# Altium schematic sheet FPGA3.SchDoc
size A4; SheetNumber: 9; SheetTotal: 9
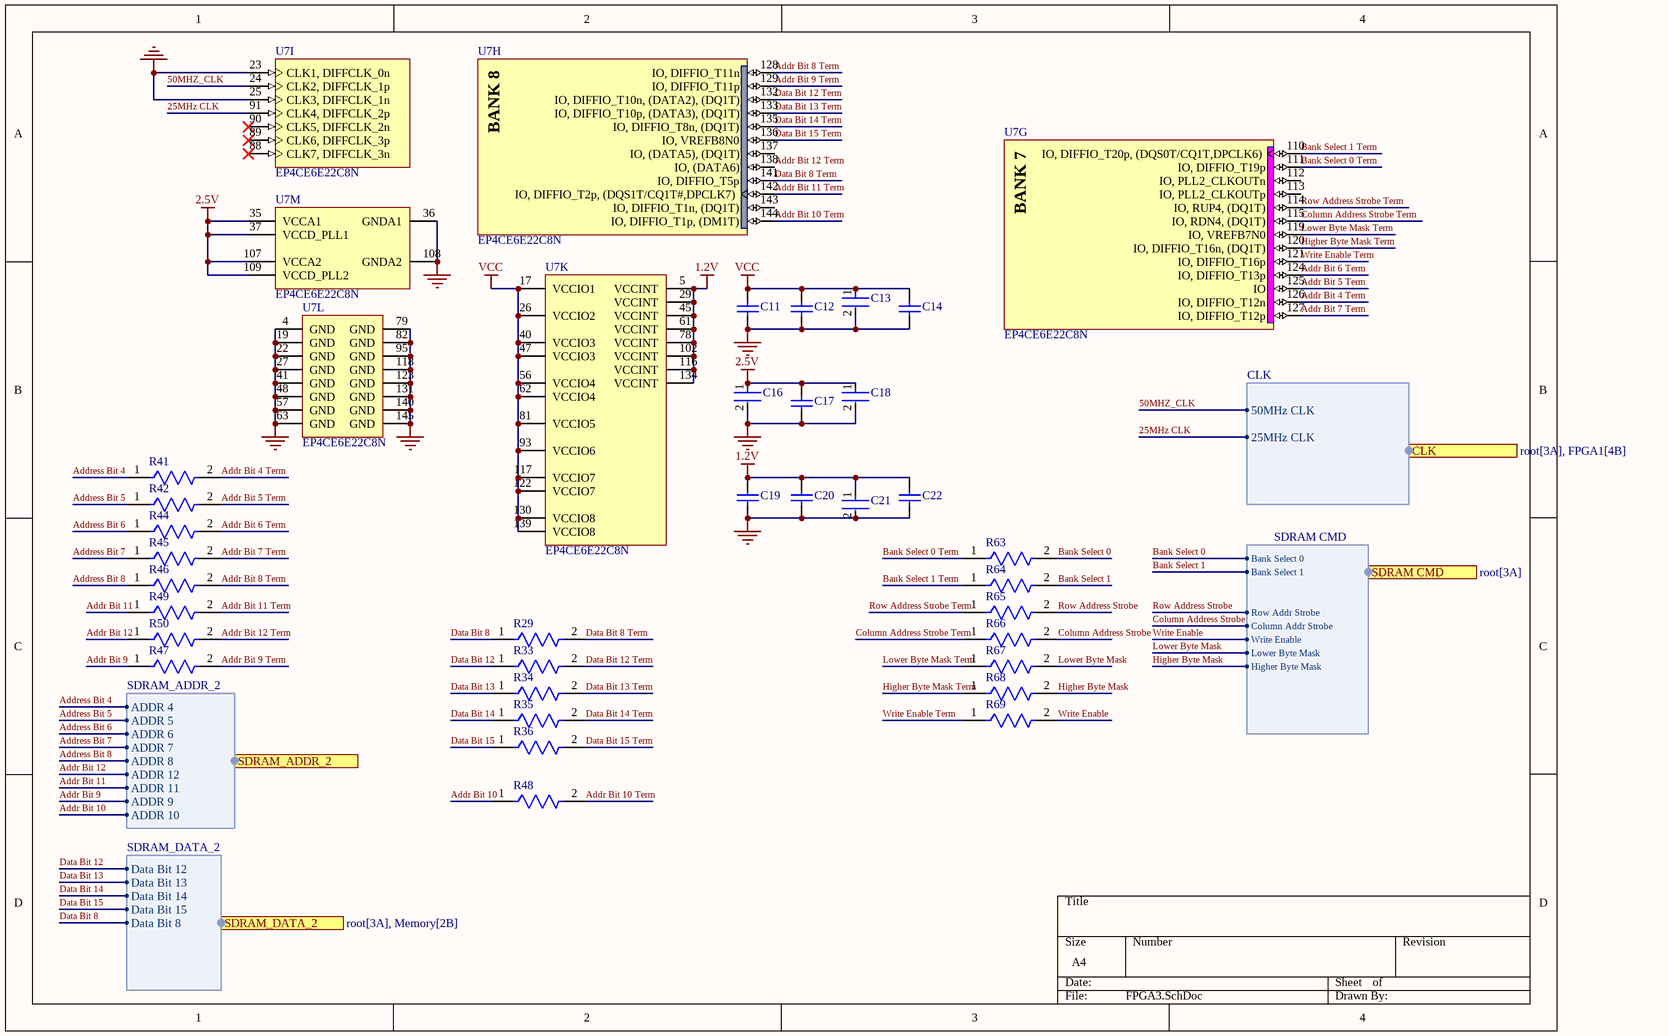
[diagram p0: FPGA3.SchDoc]

## Parts
C11  C0603C105K9PACTU  [CAPC1608X90X35LL15T15]  (value not drawn)
C12  C0603C105K9PACTU  [CAPC1608X90X35LL15T15]  (value not drawn)
C13  CC0603KRX7R9BB104  [FP-CC0603-DA-MFG]  (value not drawn)
C14  C0805S472K5RACTU  [CAPC2013X145X50ML20T25]  (value not drawn)
C16  CL10B102KB8NNNC  [FP-CL10-IPC_C]  (value not drawn)
C17  C0805S472K5RACTU  [CAPC2013X145X50ML20T25]  (value not drawn)
C18  CC0603KRX7R9BB104  [FP-CC0603-DA-MFG]  (value not drawn)
C19  C0603C105K9PACTU  [CAPC1608X90X35LL15T15]  (value not drawn)
C20  C0603C105K9PACTU  [CAPC1608X90X35LL15T15]  (value not drawn)
C21  CC0603KRX7R9BB104  [FP-CC0603-DA-MFG]  (value not drawn)
C22  C0805S472K5RACTU  [CAPC2013X145X50ML20T25]  (value not drawn)
R29  RT0402BRE0750RL  [FP-RT0402-0_35-MFG]  (value not drawn)
R33  RT0402BRE0750RL  [FP-RT0402-0_35-MFG]  (value not drawn)
R34  RT0402BRE0750RL  [FP-RT0402-0_35-MFG]  (value not drawn)
R35  RT0402BRE0750RL  [FP-RT0402-0_35-MFG]  (value not drawn)
R36  RT0402BRE0750RL  [FP-RT0402-0_35-MFG]  (value not drawn)
R41  RT0402BRE0750RL  [FP-RT0402-0_35-MFG]  (value not drawn)
R42  RT0402BRE0750RL  [FP-RT0402-0_35-MFG]  (value not drawn)
R44  RT0402BRE0750RL  [FP-RT0402-0_35-MFG]  (value not drawn)
R45  RT0402BRE0750RL  [FP-RT0402-0_35-MFG]  (value not drawn)
R46  RT0402BRE0750RL  [FP-RT0402-0_35-MFG]  (value not drawn)
R47  RT0402BRE0750RL  [FP-RT0402-0_35-MFG]  (value not drawn)
R48  RT0402BRE0750RL  [FP-RT0402-0_35-MFG]  (value not drawn)
R49  RT0402BRE0750RL  [FP-RT0402-0_35-MFG]  (value not drawn)
R50  RT0402BRE0750RL  [FP-RT0402-0_35-MFG]  (value not drawn)
R63  RT0402BRE0750RL  [FP-RT0402-0_35-MFG]  (value not drawn)
R64  RT0402BRE0750RL  [FP-RT0402-0_35-MFG]  (value not drawn)
R65  RT0402BRE0750RL  [FP-RT0402-0_35-MFG]  (value not drawn)
R66  RT0402BRE0750RL  [FP-RT0402-0_35-MFG]  (value not drawn)
R67  RT0402BRE0750RL  [FP-RT0402-0_35-MFG]  (value not drawn)
R68  RT0402BRE0750RL  [FP-RT0402-0_35-MFG]  (value not drawn)
R69  RT0402BRE0750RL  [FP-RT0402-0_35-MFG]  (value not drawn)
U7  EP4CE6E22C8N  [EQFP144_A-165_D2-54_M]  (parts G,H,I,K,L,M of 13)

## Ports
CLK (harness CLK, see root[3A], FPGA1[4B]), SDRAM CMD (harness SDRAM CMD, see root[3A]), SDRAM_ADDR_2 (harness SDRAM_ADDR_2, see root[3A], Memory[2C]), SDRAM_DATA_2 (harness SDRAM_DATA_2, see root[3A], Memory[2B])

## Harnesses
CLK: 50MHz CLK, 25MHz CLK
SDRAM CMD: Bank Select 0, Bank Select 1, Row Addr Strobe, Column Addr Strobe, Write Enable, Lower Byte Mask, Higher Byte Mask
SDRAM_ADDR_2: ADDR 4, ADDR 5, ADDR 6, ADDR 7, ADDR 8, ADDR 12, ADDR 11, ADDR 9, ADDR 10
SDRAM_DATA_2: Data Bit 12, Data Bit 13, Data Bit 14, Data Bit 15, Data Bit 8

## Nets
1.2V: C19.2 C20.2 C21.1 C22.2 U7.5(VCCINT) U7.29(VCCINT) U7.45(VCCINT) U7.61(VCCINT) U7.78(VCCINT) U7.102(VCCINT) U7.116(VCCINT) U7.134(VCCINT)
2.5V: C16.1 C17.2 C18.1 U7.35(VCCA1) U7.37(VCCD_PLL1) U7.107(VCCA2) U7.109(VCCD_PLL2)
GND: C11.1 C12.1 C13.2 C14.1 C16.2 C17.1 C18.2 C19.1 C20.1 C21.2 C22.1 U7.4(GND) U7.19(GND) U7.22(GND) U7.23(CLK1,_DIFFCLK_0n) U7.25(CLK3,_DIFFCLK_1n) U7.27(GND) U7.36(GNDA1) U7.41(GND) U7.48(GND) U7.57(GND) U7.63(GND) U7.79(GND) U7.82(GND) U7.95(GND) U7.108(GNDA2) U7.118(GND) U7.123(GND) U7.131(GND) U7.140(GND) U7.145(GND)
VCC: C11.2 C12.2 C13.1 C14.2 U7.17(VCCIO1) U7.26(VCCIO2) U7.40(VCCIO3) U7.47(VCCIO3) U7.56(VCCIO4) U7.62(VCCIO4) U7.81(VCCIO5) U7.93(VCCIO6) U7.117(VCCIO7) U7.122(VCCIO7) U7.130(VCCIO8) U7.139(VCCIO8)
25MHz CLK: U7.91(CLK4,_DIFFCLK_2p) ; port CLK.25MHz CLK
50MHZ_CLK: U7.24(CLK2,_DIFFCLK_1p) ; port CLK.50MHz CLK
Addr Bit 4 Term: R41.2 U7.126(IO,_DIFFIO_T12n)
Addr Bit 5 Term: R42.2 U7.125(IO)
Addr Bit 6 Term: R44.2 U7.124(IO,_DIFFIO_T13p)
Addr Bit 7 Term: R45.2 U7.127(IO,_DIFFIO_T12p)
Addr Bit 8 Term: R46.2 U7.128(IO,_DIFFIO_T11n)
Addr Bit 9: R47.1 ; port SDRAM_ADDR_2.ADDR 9
Addr Bit 9 Term: R47.2 U7.129(IO,_DIFFIO_T11p)
Addr Bit 10: R48.1 ; port SDRAM_ADDR_2.ADDR 10
Addr Bit 10 Term: R48.2 U7.144(IO,_DIFFIO_T1p,_(DM1T))
Addr Bit 11: R49.1 ; port SDRAM_ADDR_2.ADDR 11
Addr Bit 11 Term: R49.2 U7.142(IO,_DIFFIO_T2p,_(DQS1T/CQ1T#,DPCLK7))
Addr Bit 12: R50.1 ; port SDRAM_ADDR_2.ADDR 12
Addr Bit 12 Term: R50.2 U7.138(IO,_(DATA6))
Address Bit 4: R41.1 ; port SDRAM_ADDR_2.ADDR 4
Address Bit 5: R42.1 ; port SDRAM_ADDR_2.ADDR 5
Address Bit 6: R44.1 ; port SDRAM_ADDR_2.ADDR 6
Address Bit 7: R45.1 ; port SDRAM_ADDR_2.ADDR 7
Address Bit 8: R46.1 ; port SDRAM_ADDR_2.ADDR 8
Bank Select 0: R63.2 ; port SDRAM CMD.Bank Select 0
Bank Select 0 Term: R63.1 U7.111(IO,_DIFFIO_T19p)
Bank Select 1: R64.2 ; port SDRAM CMD.Bank Select 1
Bank Select 1 Term: R64.1 U7.110(IO,_DIFFIO_T20p,_(DQS0T/CQ1T,DPCLK6))
Column Address Strobe: R66.2 ; port SDRAM CMD.Column Addr Strobe
Column Address Strobe Term: R66.1 U7.115(IO,_RDN4,_(DQ1T))
Data Bit 8: R29.1 ; port SDRAM_DATA_2.Data Bit 8
Data Bit 8 Term: R29.2 U7.141(IO,_DIFFIO_T5p)
Data Bit 12: R33.1 ; port SDRAM_DATA_2.Data Bit 12
Data Bit 12 Term: R33.2 U7.132(IO,_DIFFIO_T10n,_(DATA2),_(DQ1T))
Data Bit 13: R34.1 ; port SDRAM_DATA_2.Data Bit 13
Data Bit 13 Term: R34.2 U7.133(IO,_DIFFIO_T10p,_(DATA3),_(DQ1T))
Data Bit 14: R35.1 ; port SDRAM_DATA_2.Data Bit 14
Data Bit 14 Term: R35.2 U7.135(IO,_DIFFIO_T8n,_(DQ1T))
Data Bit 15: R36.1 ; port SDRAM_DATA_2.Data Bit 15
Data Bit 15 Term: R36.2 U7.136(IO,_VREFB8N0)
Higher Byte Mask: R68.2 ; port SDRAM CMD.Higher Byte Mask
Higher Byte Mask Term: R68.1 U7.120(IO,_DIFFIO_T16n,_(DQ1T))
Lower Byte Mask: R67.2 ; port SDRAM CMD.Lower Byte Mask
Lower Byte Mask Term: R67.1 U7.119(IO,_VREFB7N0)
Row Address Strobe: R65.2 ; port SDRAM CMD.Row Addr Strobe
Row Address Strobe Term: R65.1 U7.114(IO,_RUP4,_(DQ1T))
Write Enable: R69.2 ; port SDRAM CMD.Write Enable
Write Enable Term: R69.1 U7.121(IO,_DIFFIO_T16p)

Not connected (* = marked no-connect by the designer): U7 88(CLK7,_DIFFCLK_3n)* 89(CLK6,_DIFFCLK_3p)* 90(CLK5,_DIFFCLK_2n)* 112(IO,_PLL2_CLKOUTn) 113(IO,_PLL2_CLKOUTp) 137(IO,_(DATA5),_(DQ1T)) 143(IO,_DIFFIO_T1n,_(DQ1T))

## Notes on the sheet
- (in symbol CMP-0038-00212-1, part G) BANK 7
- (in symbol CMP-0038-00212-1, part H) BANK 8

## Library data of the parts
C11 C12 C19 C20 = CMP-2006-02241-1: Manufacturer: Kemet; Part Number: C0603C105K9PACTU
C13 C18 C21 = CMP-2100-03601-2: CAP CER 0.1UF 50V X7R 0603; Manufacturer: YAGEO; Material: Ceramic; Capacitance: 100 nF; Temperature Coefficient: 15%; Tolerance: 0.1; Value: 100 nF; Height: 0.9mm; Voltage: 50 V; ComponentLink2Description: Datasheet; Device Class L2: Capacitors; Temperature Range High: +125°C; Category: Cap; Footprint Url: http://www.yageo.com/exep/pages/download/literatures/UPY-C_GEN_24.pdf; ComponentLink2URL: http://www.yageo.com/documents/recent/UPY-GPHC_X7R_6.3V-to-50V_18.pdf; Package: CC0603-DA; Temperature: -55°C to +125°C; Voltage Rating: 50 V; Temperature Characteristic: X7R; Device Class L1: Passive Components; Temperature Range Low: -55°C; Manufacturer Part Number: CC0603KRX7R9BB104; RoHS: TRUE; Automotive: No; Device Class L3: Ceramic Capacitors; Octopart: https://octopart.com/cc0603krx7r9bb104-yageo-42244635; Mouser Description: Multilayer Ceramic Capacitor, CC Series, 0.1 - F, - 10%, X7R, 50 V, 0603 [1608 Metric]; Lead Free: Yes; Digikey Description: CAP CER 0.1UF 50V X7R 0603
C14 C17 C22 = CMP-2007-01090-1: Manufacturer: Kemet; Part Number: C0805S472K5RACTU
C16 = CMP-2000-06091-2: Cap Ceramic 1nF 50V X7R ±10% Pad SMD 0603 +125°C T/R; Radiation Hardening: No; Length: 1.6mm; Capacitance: 1nF; Voltage Rating: 50V; Case Code (Imperial): 0603; Case Code (Metric): 1608; Max Operating Temperature: 125°C; Thickness: 0.035inch; Voltage Rating (DC): 50V; Contact Plating: Tin; Width: 0.031inch; Mount: Surface Mount; Lead Free: Lead Free; Voltage: 50V; Material: Ceramic; Package Quantity: 1; Dielectric: X7R; Case/Package: 0603; Height: 0.8mm; Min Operating Temperature: -55°C; Tolerance: 10%; Depth: 0.8mm; Packaging: Tape and Reel
R29 R33-R36 R41 R42 R44-R50 R63-R69 = CMP-00621-71392720-1: RT0402BRE0750RL Fixed Resistor, Thin Film, 0.0625W, 50ohm, 50V, 0.1% +/-Tol, 50ppm/Cel, Surface Mount, 0402; Max Power Dissipation: 63mW; Temperature Coefficient: 50ppm/°C; Resistance: 50Ω; Features: Moisture Resistant; Max Operating Temperature: 155°C; Tolerance: 0.1%; Min Operating Temperature: -55°C; Case/Package: 0402; Packaging: Tape & Reel; RoHS: Compliant; Width: 508µm; Height: 355.6µm; NexarPartId: 71392720; Composition: Thin Film; Length: 990.6µm; Number of Terminations: 2
U7 = CMP-0038-00212-1: Cyclone IV Family FPGA, 1.2V Core, 91 I/O Pins, 2 PLLs, 144-Pin QFP, Speed Grade 8, Commercial Grade, Pb-Free; Manufacturer: Altera; ComponentLink3Description: Pinout; ComponentLink4Description: Package Specification; DatasheetVersion: ver1.6, Nov-2011; ComponentLink1URL: http://www.altera.com/; ComponentLink2URL: http://www.altera.com/literature/hb/cyclone-iv/cyclone4-handbook.pdf; ComponentLink2Description: Handbook; PackageReference: EQFP144_A-165_D2-54; ComponentLink3URL: http://www.altera.com/literature/lit-dp.jsp?category=cyc%204&showspreadsheet=y; PackageVersion: ver1.0, Jan-2011; ComponentLink1Description: Manufacturer URL; ComponentLink4URL: http://www.altera.com/devicepackaging/04R00402-00.pdf; PackageDescription: 144-Pin Plastic Enhanced Quad Flat Pack (EQFP) - Wire Bond - A:1.65 - D2:5.4; Code_JEDEC: MS-026-BFB-HD